# EAGLE design i2c-display (EAGLE 9.5.0)
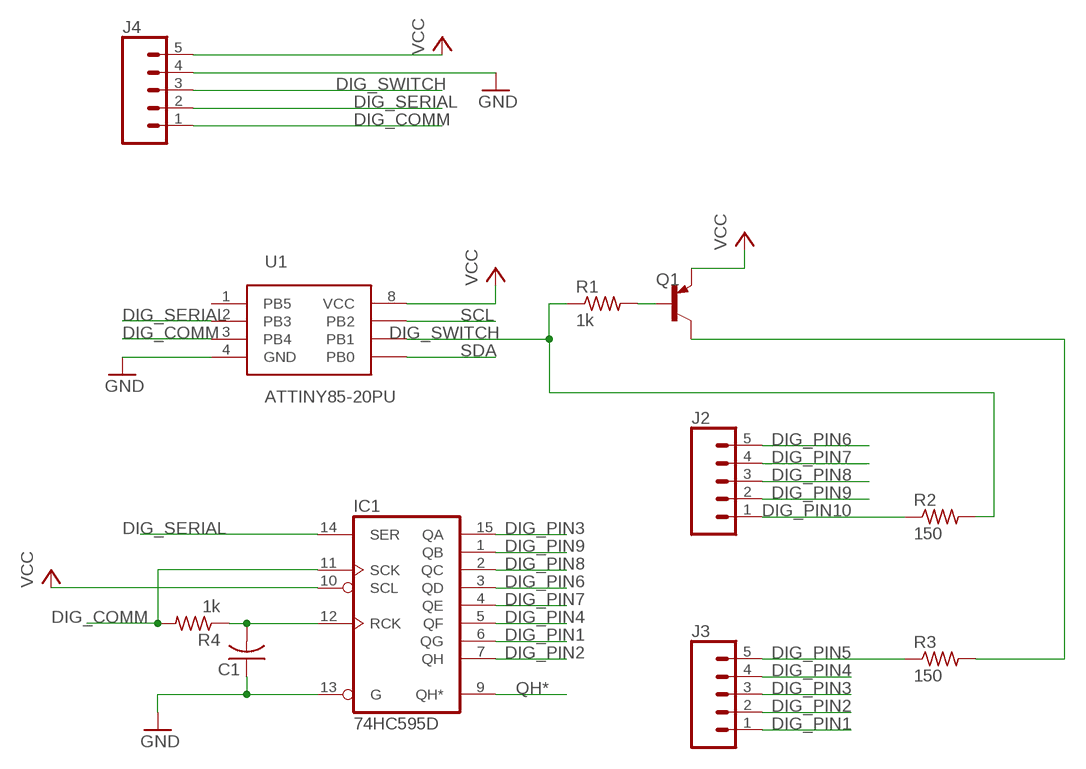
[diagram p0: schematic, sheet 1]

## Parts
C1  C-USC0603  [C0603]
IC1  74HC595D  [SO16]
J2  CONN_05NO_SILK  [1X05_NO_SILK]
J3  CONN_05NO_SILK  [1X05_NO_SILK]
J4  CONN_05  [1X05]
Q1  BCX71SMD  [SOT23]
R1  1k  R-US_R0805  [R0805]
R2  150  R-US_R0805  [R0805]
R3  150  R-US_R0805  [R0805]
R4  1k  R-US_R0805  [R0805]
U1  ATTINY85-20PU  [PDIP-8]

## Nets
DIG_COMM: IC1.11(SCK) J4.1 R4.2 U1.3(PB4)
DIG_PIN1: IC1.6(QG) J3.1
DIG_PIN2: IC1.7(QH) J3.2
DIG_PIN3: IC1.15(QA) J3.3
DIG_PIN4: IC1.5(QF) J3.4
DIG_PIN5: J3.5 R3.1
DIG_PIN6: IC1.3(QD) J2.5
DIG_PIN7: IC1.4(QE) J2.4
DIG_PIN8: IC1.2(QC) J2.3
DIG_PIN9: IC1.1(QB) J2.2
DIG_PIN10: J2.1 R2.1
DIG_SERIAL: IC1.14(SER) J4.2 U1.2(PB3)
DIG_SWITCH: J4.3 R1.1 R2.2 U1.6(PB1)
GND: C1.1 IC1.13(G) J4.4 U1.4(GND)
N$1: Q1.1(B) R1.2
N$2: Q1.3(C) R3.2
N$4: C1.2 R4.1
QH*: IC1.9(QH*)
SCL: U1.7(PB2)
SDA: U1.5(PB0)
VCC: IC1.10(SCL) J4.5 Q1.2(E) U1.8(VCC)
Unconnected: IC1.12(RCK) U1.1(PB5)

## Power pins joined to a net without a drawn wire
GND: IC1.8(GND)
VCC: IC1.16(VCC)

## Library data of the parts
C1 = rcl:C-US: CAPACITOR, American symbol; SPICEPREFIX: C
IC1 = 74xx-eu:74*595: 8-bit SHIFT REGISTER, output latch
J2-J4 = SparkFun-Connectors:CONN_05: Multi connection point. Often used as Generic Header-pin footprint for 0.1 inch spaced/style header connections On any of the 0.1 inch spaced packages, you can populate with these: Break Away Headers - Straight <https://www.sparkfun.com/products/116> (PRT-00116) Break Away Male Headers - Right Angle <https://www.sparkfun.com/products/553> (PRT-00553) Female Headers <https://www.sparkfun.com/products/115> (PRT-00115) Break Away Headers - Machine Pin <https://www.sparkfun.com/products/117> (PRT-00117) Break Away Female Headers - Swiss Machine Pin <https://www.sparkfun.com/products/743> (PRT-00743) For SCREWTERMINALS and SPRING TERMINALS visit here: Screw Terimnals on SparkFun.com <https://www.sparkfun.com/search/results?term=Screw+Terminals> (5mm/3.5mm/2.54mm spacing) This device is also useful as a general connection point to wire up your design to another part of your project. Our various solder wires solder well into these plated through hole pads. Hook-Up Wire - Assortment (Stranded, 22 AWG) <https://www.sparkfun.com/products/11375> (PRT-11375) Hook-Up Wire - Assortment (Solid Core, 22 AWG) <https://www.sparkfun.com/products/11367> (PRT-11367) View the entire wire category on our website here <https://www.sparkfun.com/categories/141> Special notes: Molex polarized connector foot print use with SKU : PRT-08231 with associated crimp pins and housings. 1MM SMD Version SKU: PRT-10208
Q1 = transistor-pnp:BCX71SMD: PNP Transistor
R1-R4 = rcl:R-US_: RESISTOR, American symbol; SPICEPREFIX: R
U1 = Microcontroller:ATTINY85-20PU: IC MCU 8BIT 8KB FLASH 8DIP Manufacturer's datasheet <http://ww1.microchip.com/downloads/en/DeviceDoc/Atmel-2586-AVR-8-bit-Microcontroller-ATtiny25-ATtiny45-ATtiny85_Datasheet-Summary.pdf>; CREATED_BY: PCBLayout.com; DIGI_KEY_PART_NUMBER: ATTINY85-20PU-ND; MANUFACTURER: Microchip Technology; MPN: ATTINY85-20PU; PACKAGE: 8-PDIP

## Board
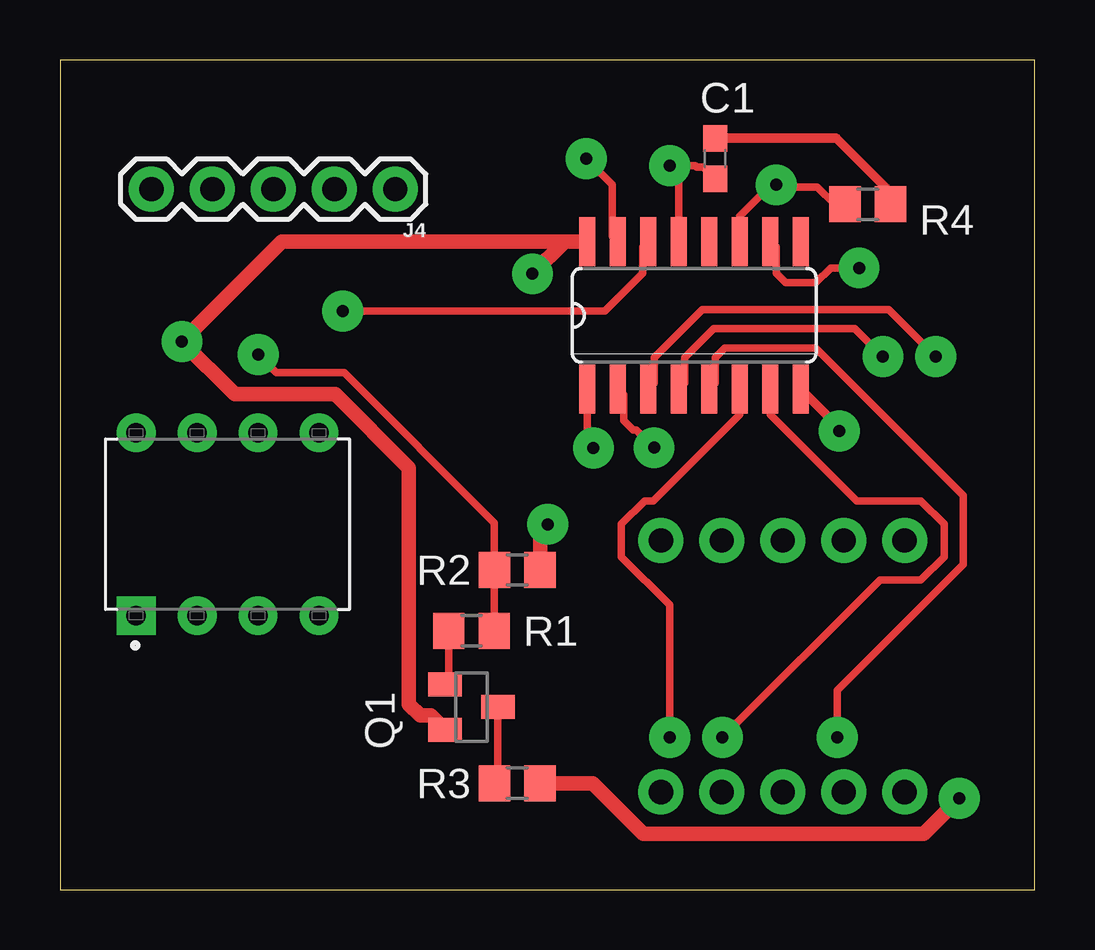
[diagram p1: board, top side]
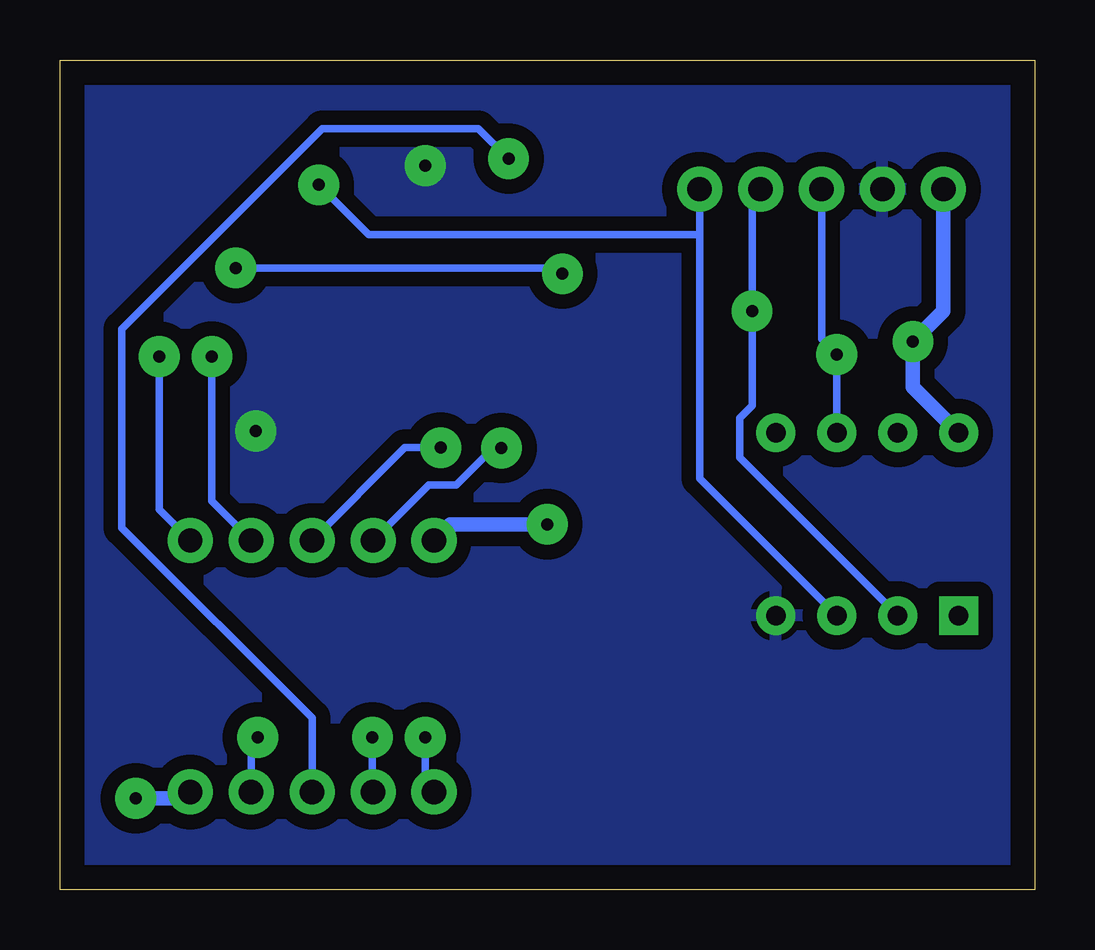
[diagram p2: board, bottom side, seen from below]

Size 40.62 x 34.59 mm. Coordinates in mm from the lower left corner, seen from the top.
Outline: 0,0 40.62,0 40.62,34.59 0,34.59 0,0
Copper layers (1*16): Top 0.035mm / dielectric 1.5mm / Bottom 0.035mm
Design rules "kraken-labs-rev4": minimum track width 0.3mm, minimum drill 0.5mm, track to track 0.4mm, track to pad 0.5mm, pad to pad 0.5mm, via to via 0.5mm, smd to smd 0.3mm, copper to edge 40mil, drill to drill 6mil, minimum pad ring 0.4mm, minimum via ring 0.6mm, stop-mask expansion 4mil, vias tented up to drill 0mil, thermal gap 10mil

### Footprints (pad centres in the part's own frame; a part is rotated, then mirrored left to right if it is on the bottom)
C0603 = smd 1.1 x 1: 1 -0.85,0; 2 0.85,0
SO16 = smd 0.66 x 2.032: 1 -4.445,-3.073; 2 -3.175,-3.073; 3 -1.905,-3.073; 4 -0.635,-3.073; 5 0.635,-3.073; 6 1.905,-3.073; 7 3.175,-3.073; 8 4.445,-3.073; 9 4.445,3.073; 10 3.175,3.073; 11 1.905,3.073; 12 0.635,3.073; 13 -0.635,3.073; 14 -1.905,3.073; 15 -3.175,3.073; 16 -4.445,3.073
1X05_NO_SILK = drill 1.016 pad 1.88: 1 0,0; 2 2.54,0; 3 5.08,0; 4 7.62,0; 5 10.16,0
1X05 = drill 1.016 pad 1.88: 1 0,0; 2 2.54,0; 3 5.08,0; 4 7.62,0; 5 10.16,0
SOT23 = smd 1 x 1.4: 1 -0.95,-1.1; 2 0.95,-1.1; 3 0,1.1
R0805 = smd 1.3 x 1.5: 1 -0.95,0; 2 0.95,0
PDIP-8 = drill 0.813 pad 1.219 square: 1 -3.81,-3.81 | drill 0.813 pad 1.219: 2 -1.27,-3.81; 3 1.27,-3.81; 4 3.81,-3.81; 5 3.81,3.81; 6 1.27,3.81; 7 -1.27,3.81; 8 -3.81,3.81

### Placement (x,y rotation side)
C1  27.3,30.48 90 top
IC1  26.42,23.95 0 top
J2  25.04,14.57 0 top
J3  25.04,4.08 0 top
J4  13.97,29.21 180 top
Q1  17.14,7.62 270 top
R1  17.14,10.79 180 top
R2  19.05,13.34 180 top
R3  19.05,4.45 180 top
R4  33.66,28.57 180 top
U1  6.99,15.24 0 top

### Tracks (layer width: path | path; a pad name or v marks a point on that pad's centre or on a via)
DIG_COMM  (via drill 0.5)
  Top 0.305: IC1.11 28.33,28.09 29.54,29.3 | 32.28,28.57 31.56,29.3 29.76,29.3
  Top 0.4: 29.54,29.3 29.76,29.3 v29.85,29.39 | R4.2 32.28,28.57
  Bottom 0.305: v29.85,29.39 27.76,27.31 13.97,27.31 | 13.97,27.31 13.97,17.14 U1.3 | J4.1 13.97,27.31
DIG_PIN1  (via drill 0.5)
  Top 0.305: IC1.6 28.33,19.81 24.72,16.2 24.36,16.2 23.39,15.24 23.39,13.89 25.4,11.88 v25.4,6.35
  Bottom 0.305: v25.4,6.35 25.4,4.45 J3.1
DIG_PIN2  (via drill 0.5)
  Top 0.305: IC1.7 29.6,19.81 33.2,16.2 35.87,16.2 36.84,15.24 36.84,13.89 35.87,12.93 34.18,12.93 v27.6,6.35
  Bottom 0.305: v27.6,6.35 27.6,4.11 J3.2
DIG_PIN3  (via drill 0.5)
  Top 0.305: IC1.15 23.02,27.25 23.02,29.39 v21.93,30.48
  Bottom 0.305: J3.3 30.12,6.98 30.12,7.17 38.04,15.09 38.04,23.39 29.69,31.74 23.19,31.74 v21.93,30.48
DIG_PIN4  (via drill 0.5)
  Top 0.305: v32.38,6.35 32.38,8.3 37.63,13.55 37.63,16.44 31.48,22.59 27.71,22.59 27.3,22.18 27.3,21.12 IC1.5
  Bottom 0.305: v32.38,6.35 32.66,6.08 J3.4
DIG_PIN5  (via drill 0.5)
  Top 0.61: R3.1 22.2,4.45 24.31,2.33 35.99,2.33 v37.47,3.81
  Bottom 0.61: v37.47,3.81 35.47,3.81 J3.5
DIG_PIN6  (via drill 0.5)
  Top 0.305: IC1.3 24.76,21.12 24.76,22.18 26.77,24.19 34.52,24.19 v36.49,22.22
  Bottom 0.305: v36.49,22.22 36.49,15.86 J2.5
DIG_PIN7  (via drill 0.5)
  Top 0.305: IC1.4 26.03,21.12 26.03,22.18 27.23,23.39 33.12,23.39 v34.29,22.22
  Bottom 0.305: v34.29,22.22 34.29,16.2 J2.4
DIG_PIN8  (via drill 0.5)
  Top 0.305: IC1.2 23.48,20.64 23.48,19.57 23.89,19.16 24.02,19.16 v24.75,18.43
  Bottom 0.305: v24.75,18.43 26.25,18.43 J2.3
DIG_PIN9  (via drill 0.5)
  Top 0.305: IC1.1 21.98,18.66 v22.23,18.41
  Bottom 0.305: J2.2 25.26,16.88 24.11,16.88 22.57,18.41 v22.23,18.41
DIG_PIN10  (via drill 0.5)
  Top 0.61: R2.1 20,14.92 v20.32,15.24
  Bottom 0.61: v20.32,15.24 24.36,15.24 J2.1
DIG_SERIAL  (via drill 0.5)
  Top 0.305: IC1.14 24.28,26.78 24.28,25.72 22.69,24.13 v11.79,24.13
  Bottom 0.305: U1.2 12.3,18.02 12.3,19.67 11.79,20.19 v11.79,24.13 11.79,28.86 J4.2
DIG_SWITCH  (via drill 0.5)
  Top 0.305: R1.1 R2.2 18.1,15.3 11.84,21.57 9,21.57 v8.25,22.32
  Top 0.4: R1.1
  Bottom 0.305: U1.6 v8.25,22.32 8.89,22.95 J4.3
GND  (via drill 0.5)
  Top 0.305: IC1.13 25.79,29.8 v25.4,30.19 26.47,30.19 26.54,30.13 26.81,30.13 C1.1
  Top 0.4: IC1.8 32.47,19.27 v32.47,19.13
  pour Bottom (isolate 0.61): 0,34.92 40.64,34.92 40.64,0 0,0
N$1
  Top 0.305: R1.2 16.2,8.72
  Top 0.4: 16.2,8.72 Q1.1
N$2
  Top 0.305: Q1.3 18.25,4.59
  Top 0.4: 18.25,4.59 R3.2
N$4
  Top 0.4: R4.1 34.61,29.07 32.34,31.33 C1.2
VCC  (via drill 0.5)
  Top 0.305: IC1.10 29.84,26.78 29.84,25.72 30.25,25.31 31.48,25.31 32.1,25.93 v33.29,25.93
  Top 0.61: Q1.2 15.45,7.27 15.01,7.27 14.54,7.74 14.54,17.58 11.46,20.66 7.28,20.66 v5.08,22.86 9.24,27.02 IC1.16 21.03,27.02 v19.69,25.68
  Bottom 0.305: v33.29,25.93 19.93,25.93
  Bottom 0.4: v19.69,25.68 19.93,25.93
  Bottom 0.61: U1.8 5.08,20.95 v5.08,22.86 3.81,24.13 J4.5